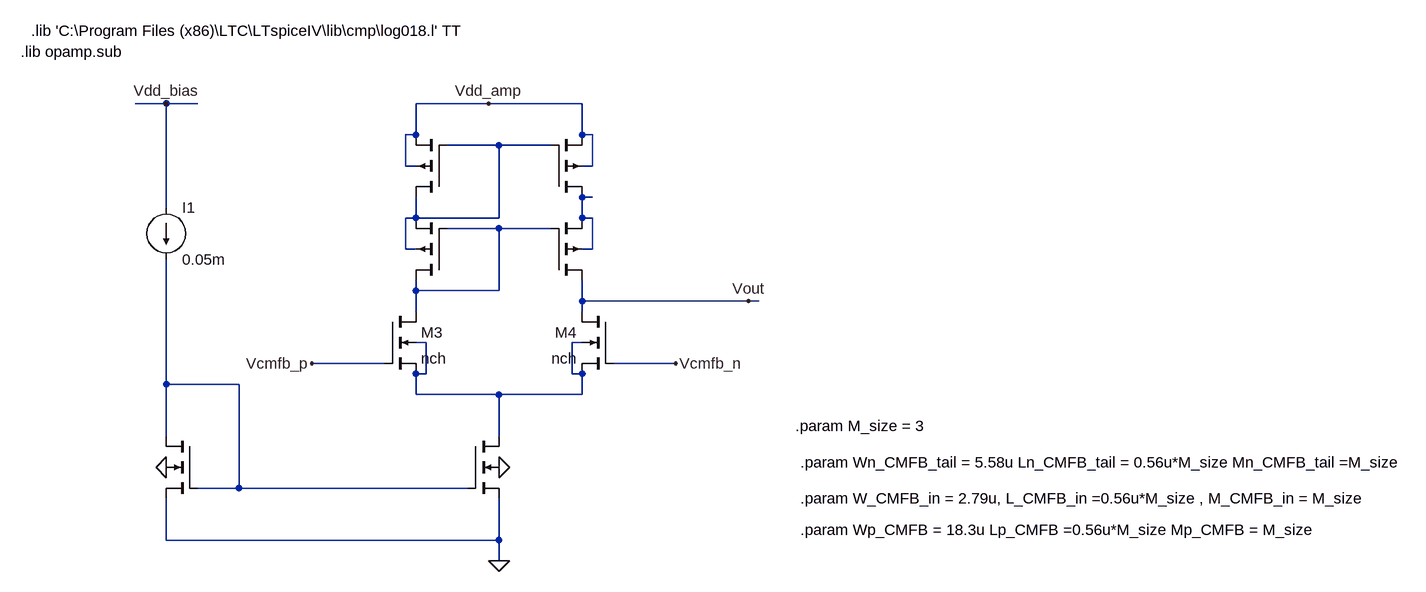
[diagram p0: schematic CMFB_Amplifier_comp_model.asc]
CMFB_Amplifier_comp_model.asc, the LTspice schematic file:
Version 4
SHEET 1 2296 852
WIRE -1136 -640 -1184 -640
WIRE -1088 -640 -1136 -640
WIRE -640 -640 -752 -640
WIRE -496 -640 -640 -640
WIRE -752 -592 -752 -640
WIRE -752 -592 -768 -592
WIRE -496 -592 -496 -640
WIRE -480 -592 -496 -592
WIRE -624 -576 -704 -576
WIRE -576 -576 -624 -576
WIRE -544 -576 -576 -576
WIRE -768 -544 -768 -592
WIRE -752 -544 -768 -544
WIRE -480 -544 -480 -592
WIRE -480 -544 -496 -544
WIRE -480 -496 -496 -496
WIRE -1136 -480 -1136 -640
WIRE -752 -464 -752 -496
WIRE -752 -464 -768 -464
WIRE -624 -464 -624 -576
WIRE -624 -464 -752 -464
WIRE -496 -464 -496 -496
WIRE -480 -464 -496 -464
WIRE -624 -448 -704 -448
WIRE -576 -448 -624 -448
WIRE -544 -448 -576 -448
WIRE -768 -416 -768 -464
WIRE -752 -416 -768 -416
WIRE -480 -416 -480 -464
WIRE -480 -416 -496 -416
WIRE -752 -352 -752 -368
WIRE -624 -352 -624 -448
WIRE -624 -352 -752 -352
WIRE -496 -336 -496 -368
WIRE -416 -336 -496 -336
WIRE -240 -336 -416 -336
WIRE -224 -336 -240 -336
WIRE -752 -320 -752 -352
WIRE -496 -320 -496 -336
WIRE -736 -272 -752 -272
WIRE -496 -272 -512 -272
WIRE -864 -240 -912 -240
WIRE -800 -240 -864 -240
WIRE -400 -240 -448 -240
WIRE -352 -240 -400 -240
WIRE -736 -224 -736 -272
WIRE -736 -224 -752 -224
WIRE -512 -224 -512 -272
WIRE -496 -224 -512 -224
WIRE -1136 -208 -1136 -400
WIRE -1024 -208 -1136 -208
WIRE -752 -192 -752 -224
WIRE -624 -192 -752 -192
WIRE -496 -192 -496 -224
WIRE -496 -192 -624 -192
WIRE -1136 -128 -1136 -208
WIRE -624 -128 -624 -192
WIRE -1024 -48 -1024 -208
WIRE -1024 -48 -1088 -48
WIRE -912 -48 -1024 -48
WIRE -672 -48 -912 -48
WIRE -1136 32 -1136 -32
WIRE -624 32 -624 -32
WIRE -624 32 -1136 32
WIRE -624 64 -624 32
FLAG -624 64 0
FLAG -624 -80 0
FLAG -1136 -80 0
FLAG -640 -640 Vdd_amp
FLAG -240 -336 Vout
FLAG -912 -240 Vcmfb_p
FLAG -352 -240 Vcmfb_n
FLAG -1136 -640 Vdd_bias
DATAFLAG -624 -192 "round($*1000)/1000"
DATAFLAG -912 -48 ""
DATAFLAG -416 -336 "round($*1000)/1000"
DATAFLAG -576 -576 "round($*1000)/1000"
DATAFLAG -688 -144 "round(Id(x6:x5:M5)*100000000)/100000000"
DATAFLAG -800 -480 "round(-Id(x6:x5:M1)*100000000)/100000000"
DATAFLAG -576 -448 "round($*1000)/1000"
DATAFLAG -864 -240 "round($*1000)/1000"
DATAFLAG -400 -240 "round($*1000)/1000"
DATAFLAG -480 -496 "round($*1000)/1000"
SYMBOL pmos4 -704 -496 R180
WINDOW 0 56 32 Invisible 2
WINDOW 3 56 72 Invisible 2
SYMATTR InstName M1
SYMATTR Value pch
SYMATTR Value2 l={Lp_CMFB} w={Wp_CMFB} m={Mp_CMFB}
SYMBOL pmos4 -544 -496 M180
WINDOW 0 56 32 Invisible 2
WINDOW 3 56 72 Invisible 2
SYMATTR InstName M2
SYMATTR Value pch
SYMATTR Value2 l={Lp_CMFB} w={Wp_CMFB} m={Mp_CMFB}
SYMBOL nmos4 -800 -320 R0
SYMATTR InstName M3
SYMATTR Value nch
SYMATTR Value2 l={L_CMFB_in} w={W_CMFB_in} m={M_CMFB_in}
SYMBOL nmos4 -448 -320 M0
SYMATTR InstName M4
SYMATTR Value nch
SYMATTR Value2 l={L_CMFB_in} w={W_CMFB_in} m={M_CMFB_in}
SYMBOL nmos4 -672 -128 R0
WINDOW 0 56 32 Invisible 2
WINDOW 3 56 72 Invisible 2
SYMATTR InstName M5
SYMATTR Value nch
SYMATTR Value2 l={Ln_CMFB_tail} w={Wn_CMFB_tail} m={Mn_CMFB_tail}
SYMBOL current -1136 -480 R0
WINDOW 123 0 0 Left 2
WINDOW 39 0 0 Left 2
SYMATTR InstName I1
SYMATTR Value 0.05m
SYMBOL nmos4 -1088 -128 M0
WINDOW 0 56 32 Invisible 2
WINDOW 3 56 72 Invisible 2
SYMATTR InstName M8
SYMATTR Value nch
SYMATTR Value2 l={Ln_CMFB_tail} w={Wn_CMFB_tail} m={Mn_CMFB_tail}
SYMBOL pmos4 -704 -368 R180
WINDOW 0 56 32 Invisible 2
WINDOW 3 56 72 Invisible 2
SYMATTR InstName M6
SYMATTR Value pch
SYMATTR Value2 l={Lp_CMFB} w={Wp_CMFB} m={Mp_CMFB}
SYMBOL pmos4 -544 -368 M180
WINDOW 0 56 32 Invisible 2
WINDOW 3 56 72 Invisible 2
SYMATTR InstName M7
SYMATTR Value pch
SYMATTR Value2 l={Lp_CMFB} w={Wp_CMFB} m={Mp_CMFB}
TEXT -1344 -752 Left 2 !.lib 'C:\\Program Files (x86)\\LTC\\LTspiceIV\\lib\\cmp\\log018.l' TT
TEXT -1360 -720 Left 2 !.lib opamp.sub
TEXT -160 -88 Left 2 !.param Wn_CMFB_tail = 5.58u Ln_CMFB_tail = 0.56u*M_size Mn_CMFB_tail =M_size
TEXT -168 -144 Left 2 !.param M_size = 3
TEXT -160 -32 Left 2 !.param W_CMFB_in = 2.79u, L_CMFB_in =0.56u*M_size , M_CMFB_in = M_size
TEXT -160 16 Left 2 !.param Wp_CMFB = 18.3u Lp_CMFB =0.56u*M_size Mp_CMFB = M_size

The netlist it stands for:
* CMFB_Amplifier_comp_model.asc
M1 N001 N001 Vdd_amp Vdd_amp pch l={Lp_CMFB} w={Wp_CMFB} m={Mp_CMFB}
M2 N002 N001 Vdd_amp Vdd_amp pch l={Lp_CMFB} w={Wp_CMFB} m={Mp_CMFB}
M3 N003 Vcmfb_p N004 N004 nch l={L_CMFB_in} w={W_CMFB_in} m={M_CMFB_in}
M4 Vout Vcmfb_n N004 N004 nch l={L_CMFB_in} w={W_CMFB_in} m={M_CMFB_in}
M5 N004 N005 0 0 nch l={Ln_CMFB_tail} w={Wn_CMFB_tail} m={Mn_CMFB_tail}
I1 Vdd_bias N005 0.05m
M8 N005 N005 0 0 nch l={Ln_CMFB_tail} w={Wn_CMFB_tail} m={Mn_CMFB_tail}
M6 N003 N003 N001 N001 pch l={Lp_CMFB} w={Wp_CMFB} m={Mp_CMFB}
M7 Vout N003 N002 N002 pch l={Lp_CMFB} w={Wp_CMFB} m={Mp_CMFB}
.model NMOS NMOS
.model PMOS PMOS
.lib standard.mos
.lib 'C:\Program Files (x86)\LTC\LTspiceIV\lib\cmp\log018.l' TT
.lib opamp.sub
.param Wn_CMFB_tail = 5.58u Ln_CMFB_tail = 0.56u*M_size Mn_CMFB_tail =M_size
.param M_size = 3
.param W_CMFB_in = 2.79u, L_CMFB_in =0.56u*M_size , M_CMFB_in = M_size
.param Wp_CMFB = 18.3u Lp_CMFB =0.56u*M_size Mp_CMFB = M_size
.backanno
.end